# Altium schematic sheet CPU_100M_Ethernet.SchDoc
size A3; PageSetup: Record=PageOptions|CenterHorizontal=True|CenterVertical=True|PrintScale=1.42|XCorrection=1.00|YCorrection=1.00|PrintKind=1|BorderSize=5000000|LeftOffset=0|BottomOffset=0|Orientation=2|PaperLength=1000|PaperWidth=1000|Scale=100|PaperSource=7|PrintQuality=-4|MediaType=1|DitherType=10|PaperKind=A3|PrintScaleMode=1
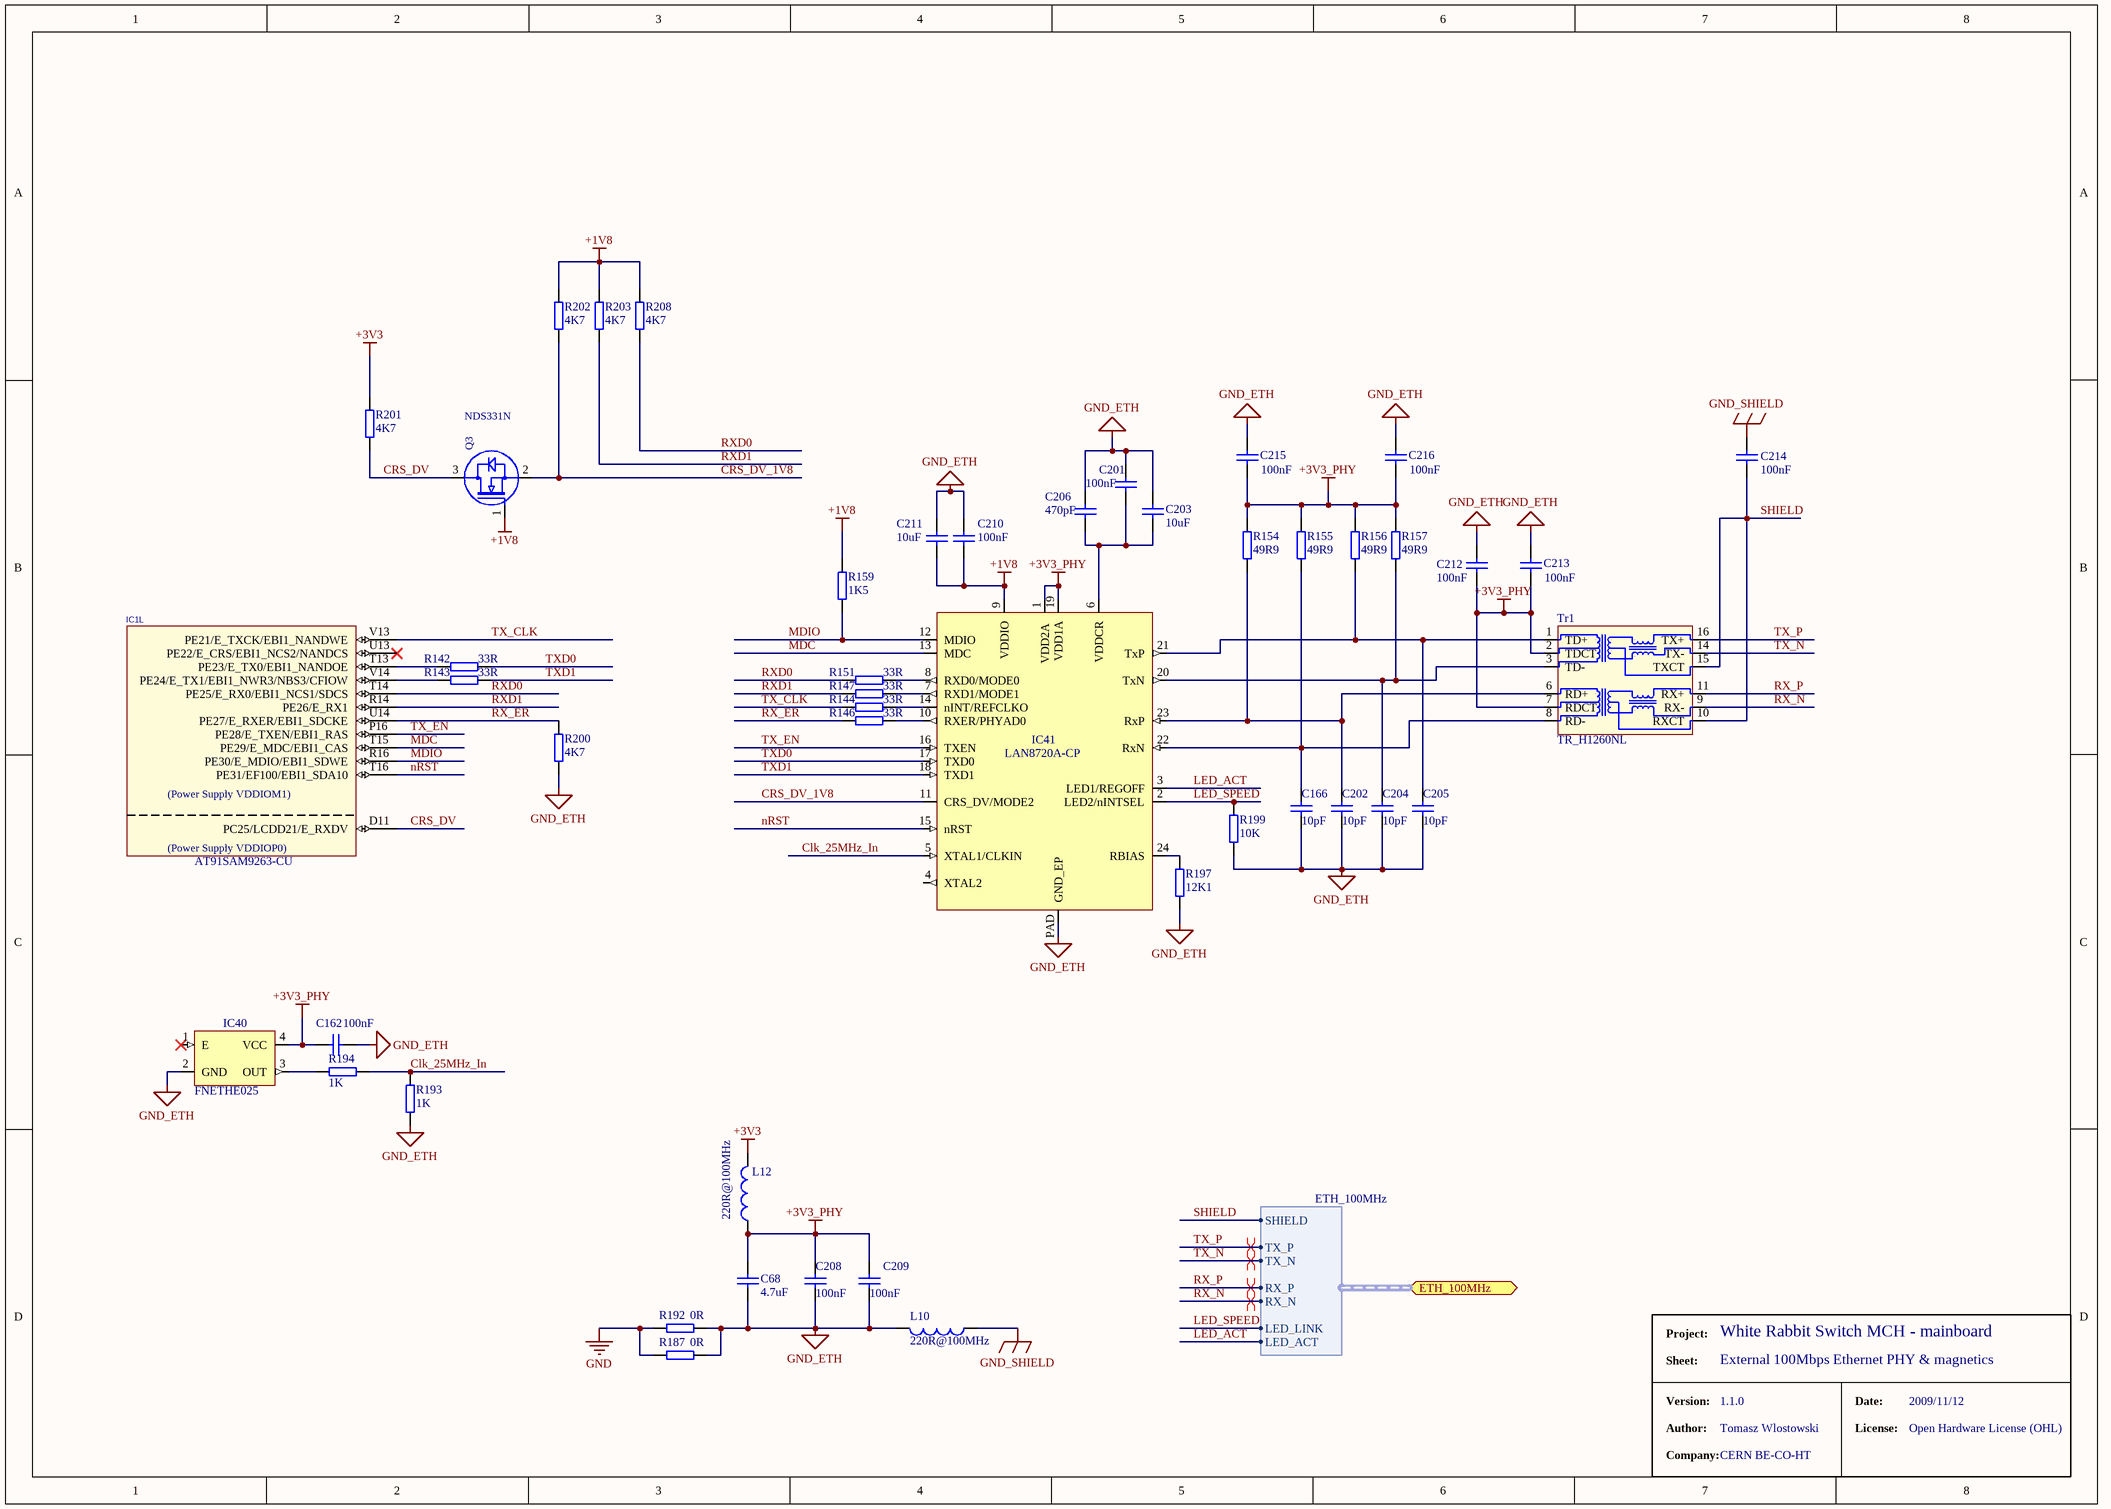
[diagram p0: CPU_100M_Ethernet.SchDoc]

## Parts
C68  4.7uF  [CC1608-0603]
C162  100nF  [CC1005-0402]
C166  10pF  [CC1005-0402]
C201  100nF  [CC1005-0402]
C202  10pF  [CC1005-0402]
C203  10uF  [CC1608-0603]
C204  10pF  [CC1005-0402]
C205  10pF  [CC1005-0402]
C206  470pF  [CC1005-0402]
C208  100nF  [CC1005-0402]
C209  100nF  [CC1005-0402]
C210  100nF  [CC1005-0402]
C211  10uF  [CC1608-0603]
C212  100nF  [CC1005-0402]
C213  100nF  [CC1005-0402]
C214  100nF  [CC1608-0603]
C215  100nF  [CC1005-0402]
C216  100nF  [CC1005-0402]
IC1  AT91SAM9263-CU  [TFBGA324]  (part L of 12)
IC40  FNETHE025  [SPXO]
IC41  LAN8720A-CP  [QFN50P400X400-24W4M]
L10  Impedance: 220R@100MHz  [0603]  (hidden comment: 220R@100MHz Ferrite Bead)
L12  Impedance: 220R@100MHz  [0603]  (hidden comment: 220R@100MHz Ferrite Bead)
Q3  NDS331N  [SOT23-3]
R142  33R  [0402]
R143  33R  [0402]
R144  33R  [0402]
R146  33R  [0402]
R147  33R  [0402]
R151  33R  [0402]
R154  49R9  [0603]
R155  49R9  [0603]
R156  49R9  [0603]
R157  49R9  [0603]
R159  1K5  [0402]
R187  value 0R  [0402]  (hidden comment: Jumper)
R192  value 0R  [0402]  (hidden comment: Jumper)
R193  1K  [0402]
R194  1K  [0402]
R197  12K1  [0402]
R199  10k  [0402]
R200  4K7  [0402]
R201  4K7  [0402]
R202  4K7  [0402]
R203  4K7  [0402]
R208  4K7  [0402]
Tr1  TR_H1260NL  [H1260NL]

## Ports
ETH_100MHz (harness ETH_100MHz)

## Harnesses
ETH_100MHz: SHIELD, RX_P, TX_P, TX_N, RX_N, LED_LINK, LED_ACT

## Nets
+1V8: C210.2 C211.2 IC41.9(VDDIO) Q3.1(GATE) R159.2 R202.2 R203.2 R208.2
+3V3: L12.2 R201.2
+3V3_PHY: C68.2 C162.2 C208.1 C209.1 C212.1 C213.1 C215.1 C216.1 IC40.4(VCC) IC41.1(VDD2A) IC41.19(VDD1A) L12.1 R154.2 R155.2 R156.2 R157.2 Tr1.2(TDCT) Tr1.7(RDCT)
GND: R187.2 R192.2
GND_ETH: C68.1 C162.1 C166.1 C201.1 C202.1 C203.1 C204.1 C205.1 C206.2 C208.2 C209.2 C210.1 C211.1 C212.2 C213.2 C215.2 C216.2 IC40.2(GND) IC41.PAD(GND_EP) L10.2 R187.1 R192.1 R193.1 R197.2 R199.1 R200.2
GND_SHIELD: C214.2 L10.1
Clk_25MHz_In: IC41.5(XTAL1/CLKIN) R193.2 R194.2
CRS_DV: IC1.D11(PC25/LCDD21/E_RXDV) Q3.3(DRAIN) R201.1
CRS_DV_1V8: IC41.11(CRS_DV/MODE2) Q3.2(SOURCE) R202.1
LED_ACT: IC41.3(LED1/REGOFF) ; port ETH_100MHz.LED_ACT
LED_SPEED: IC41.2(LED2/nINTSEL) R199.2 ; port ETH_100MHz.LED_LINK
MDC: IC1.T15(PE29/E_MDC/EBI1_CAS) IC41.13(MDC)
MDIO: IC1.R16(PE30/E_MDIO/EBI1_SDWE) IC41.12(MDIO) R159.1
nRST: IC1.T16(PE31/EF100/EBI1_SDA10) IC41.15(nRST)
RX_ER: IC1.U14(PE27/E_RXER/EBI1_SDCKE) R146.1 R200.1
RX_N: Tr1.9(RX-) ; port ETH_100MHz.RX_N
RX_P: Tr1.11(RX+) ; port ETH_100MHz.RX_P
RXD0: IC1.T14(PE25/E_RX0/EBI1_NCS1/SDCS) R151.1 R208.1
RXD1: IC1.R14(PE26/E_RX1) R147.1 R203.1
SHIELD: C214.1 Tr1.10(RXCT) Tr1.15(TXCT) ; port ETH_100MHz.SHIELD
TX_CLK: IC1.V13(PE21/E_TXCK/EBI1_NANDWE) R144.1
TX_EN: IC1.P16(PE28/E_TXEN/EBI1_RAS) IC41.16(TXEN)
TX_N: Tr1.14(TX-) ; port ETH_100MHz.TX_N
TX_P: Tr1.16(TX+) ; port ETH_100MHz.TX_P
TXD0: IC41.17(TXD0) R142.2
TXD1: IC41.18(TXD1) R143.2
NetC166_2: C166.2 IC41.22(RxN) R155.1 Tr1.8(RD-)
NetC201_2: C201.2 C203.2 C206.1 IC41.6(VDDCR)
NetC202_2: C202.2 IC41.23(RxP) R154.1 Tr1.6(RD+)
NetC204_2: C204.2 IC41.20(TxN) R157.1 Tr1.3(TD-)
NetC205_2: C205.2 IC41.21(TxP) R156.1 Tr1.1(TD+)
NetIC1_T13: IC1.T13(PE23/E_TX0/EBI1_NANDOE) R142.1
NetIC1_V14: IC1.V14(PE24/E_TX1/EBI1_NWR3/NBS3/CFIOW) R143.1
NetIC40_3: IC40.3(OUT) R194.1
NetIC41_7: IC41.7(RXD1/MODE1) R147.2
NetIC41_8: IC41.8(RXD0/MODE0) R151.2
NetIC41_10: IC41.10(RXER/PHYAD0) R146.2
NetIC41_14: IC41.14(nINT/REFCLKO) R144.2
NetIC41_24: IC41.24(RBIAS) R197.1

Not connected (* = marked no-connect by the designer): IC1 U13(PE22/E_CRS/EBI1_NCS2/NANDCS)*; IC40 1(E)*; IC41 4(XTAL2)

## Layout directives
differential pair: RX_N, RX_P, TX_N, TX_P

## Notes on the sheet
- Project:
- Sheet:
- External 100Mbps Ethernet PHY & magnetics
- White Rabbit Switch MCH - mainboard
- Version:
- Author:
- Company:
- 1.1.0
- Tomasz Wlostowski
- CERN BE-CO-HT
- Date:
- License:
- 2009/11/12
- Open Hardware License (OHL)
- (in symbol AT91SAM9263, part L) (Power Supply VDDIOM1); (Power Supply VDDIOP0)

## Library data of the parts
C68 = CC0603_4.7UF_10V_10%_X5R: Capacitor; Manufacturer1: TDK; Manufacturer1 PN: C1608X5R1A475K; TC: X5R; Tolerance: ±10%; Voltage: 10V; Published: 8-Jun-2000; LatestRevisionDate: 17-Jul-2002; LatestRevisionNote: Re-released for DXP Platform.; PackageReference: RAD-0.3; Publisher: Altium Limited; Distributor1: Digikey; Distributor1 PN: 445-5170-1-ND; Case: 0603; Value: 4.7uF
C162 C201 C208-C210 C212 C213 C215 C216 = CC0402_100NF_16V_10%_X7R: Capacitor; Manufacturer1: TDK; Manufacturer1 PN: C1005X7R1C104K; TC: X7R; Tolerance: ±10%; Voltage: 16V; Published: 8-Jun-2000; LatestRevisionDate: 17-Jul-2002; LatestRevisionNote: Re-released for DXP Platform.; PackageReference: RAD-0.3; Publisher: Altium Limited; Distributor1: Digikey; Distributor1 PN: 445-4952-1-ND; Case: 0402; Value: 100nF
C166 C202 C204 C205 = CC0402_10PF_50V_5%_NP0: Capacitor; Manufacturer1: TDK; Manufacturer1 PN: C1005C0G1H100D; TC: NPO; Tolerance: ±10%; Voltage: 50V; Published: 8-Jun-2000; LatestRevisionDate: 17-Jul-2002; LatestRevisionNote: Re-released for DXP Platform.; PackageReference: RAD-0.3; Publisher: Altium Limited; Distributor1: Digikey; Distributor1 PN: 445-1235-1-ND; Case: 0402; Value: 10pF
C203 C211 = CC0603_10UF_6.3V_20%_X5R: Capacitor; Manufacturer1: TDK; Manufacturer1 PN: C1608X5R0J106M; TC: X5R; Tolerance: ±20%; Voltage: 6.3V; Published: 8-Jun-2000; LatestRevisionDate: 17-Jul-2002; LatestRevisionNote: Re-released for DXP Platform.; PackageReference: RAD-0.3; Publisher: Altium Limited; Distributor1: Digikey; Distributor1 PN: 445-4112-1-ND; Case: 0603; Value: 10uF
C206 = CC0402_470PF_50V_10%_X7R: Capacitor; Manufacturer1: TDK; Manufacturer1 PN: C1005X7R1H471K; TC: X7R; Tolerance: ±10%; Voltage: 50V; Published: 8-Jun-2000; LatestRevisionDate: 17-Jul-2002; LatestRevisionNote: Re-released for DXP Platform.; PackageReference: RAD-0.3; Publisher: Altium Limited; Distributor1: Digikey; Distributor1 PN: 445-1255-1-ND; Case: 0402; Value: 470pF
C214 = CC0603_100NF_50V_10%_X7R: Capacitor; Manufacturer1: Phycomp; Manufacturer1 PN: CC0603KRX7R9BB104; TC: X7R; Tolerance: ±10%; Voltage: 50V; Published: 8-Jun-2000; LatestRevisionDate: 17-Jul-2002; LatestRevisionNote: Re-released for DXP Platform.; Publisher: Altium Limited; Distributor1: Digikey; Distributor1 PN: 311-1344-1-ND; Case: 0603; Value: 100nF
IC1 = AT91SAM9263: Atmel ARM926 MCU; Supplier: EBV; RefId: AT91SAM9263-CU; Value: AT91SAM9263-CU
IC40 = OSC_CFPS-73: SMD oscillator 3.3V (Elfa); Value: FNETHE025; Distributor: Digikey; Distributor PN: FNETHE025CT-ND
IC41 = LAN8720A-CP: RMII ethernet transceiver with auto MIDIX; Manufacturer: SMSC; Value: LAN8720A-CP; Distributor1: Digikey; Distributor1 PN: 638-1080-ND
L10 L12 = L_FERRITE_BEAD: ferrite bead; Manufacturer1: Murata; Manufacturer1 PN: BLM18KG221SN1D; Current Rating: 2.2A; DCR: 50mOhm; Case: 0603; Distributor1: Digikey; Distributor1 PN: 490-5255-1-ND
Q3 = NDS331N: N-Channel Logic Level Enhancement Mode Field Effect Transistor; DEVICE: NDS331N; VALUE: NDS331N; Distributor1 PN: NDS331NCT-ND; Distributor1: Digikey
R142-R144 R146 R147 R151 = R0402_33R_±1%_0.1W_100PPM: SMD Resistor; Manufacturer1: Panasonic; Manufacturer1 PN: ERJ-2RKF33R0X; TCR: 100ppm; Power Rating: 0.1W; Tolerance: ±1%; Case: 0402; Distributor1: DigiKey; Distributor1 PN: P33.0LCT-ND; Value: 33R
R154-R157 = R0603_49R9_±1%_0.25W_100PPM: SMD Resistor; Manufacturer1: Vishay/Dale; Manufacturer1 PN: CRCW060349R9FKEAHP; TCR: 100ppm; Power Rating: 0.25W; Tolerance: ±1%; Case: 0603; Distributor1: DigiKey; Distributor1 PN: 541-49.9SCT-ND; Value: 49R9
R159 = R0402_1K5_±1%_0.1W_100PPM: SMD Resistor; Manufacturer1: Panasonic; Manufacturer1 PN: ERJ-2RKF1501X; TCR: 100ppm; Power Rating: 0.1W; Tolerance: ±1%; Case: 0402; Distributor1: DigiKey; Distributor1 PN: P1.50KLCT-ND; Value: 1K5
R187 R192 = R0402_0R_0.1W_JUMPER: SMD Resistor; Manufacturer1: Panasonic; Manufacturer1 PN: ERJ-2GE0R00X; TCR: 100ppm; Power Rating: 0.1W; Case: 0402; Distributor1: DigiKey; Distributor1 PN: P0.0JCT-ND; Tolerance: Jumper
R193 R194 = R0402_1K_±1%_0.1W_100PPM: SMD Resistor; Manufacturer1: Panasonic; Manufacturer1 PN: ERJ-2RKF1001X; TCR: 100ppm; Power Rating: 0.1W; Tolerance: ±1%; Case: 0402; Distributor1: DigiKey; Distributor1 PN: P1.00KLCT-ND; Value: 1K
R197 = R0402_12K1_±1%_0.1W_100PPM: SMD Resistor; Manufacturer1: Panasonic; Manufacturer1 PN: ERJ-2RKF1212X; TCR: 100ppm; Power Rating: 0.1W; Tolerance: ±1%; Case: 0402; Distributor1: DigiKey; Distributor1 PN: P12.1KLCT-ND; Value: 12K1
R199 = R0402_10K_±1%_0.1W_100PPM: SMD Resistor; Manufacturer1: Panasonic; Manufacturer1 PN: ERJ-2RKF1002X; TCR: 100ppm; Power Rating: 0.1W; Tolerance: ±1%; Case: 0402; Distributor1: DigiKey; Distributor1 PN: P10.0KLCT-ND; Value: 10K
R200-R203 R208 = R0402_4.7K_±1%_0.1W_100PPM: SMD Resistor; Manufacturer1: Panasonic; Manufacturer1 PN: ERJ-2RKF4701X; TCR: 100ppm; Power Rating: 0.1W; Tolerance: ±1%; Case: 0402; Distributor1: DigiKey; Distributor1 PN: ERJ-2RKF4701X; Value: 4K7
Tr1 = TR_H1260NL: ethernet trafo (TME); Value: H1260NL; Distributor1 PN: 553-1328-ND; Distributor1: Digikey